# EAGLE design 2 byte output (EAGLE 9.4.2)
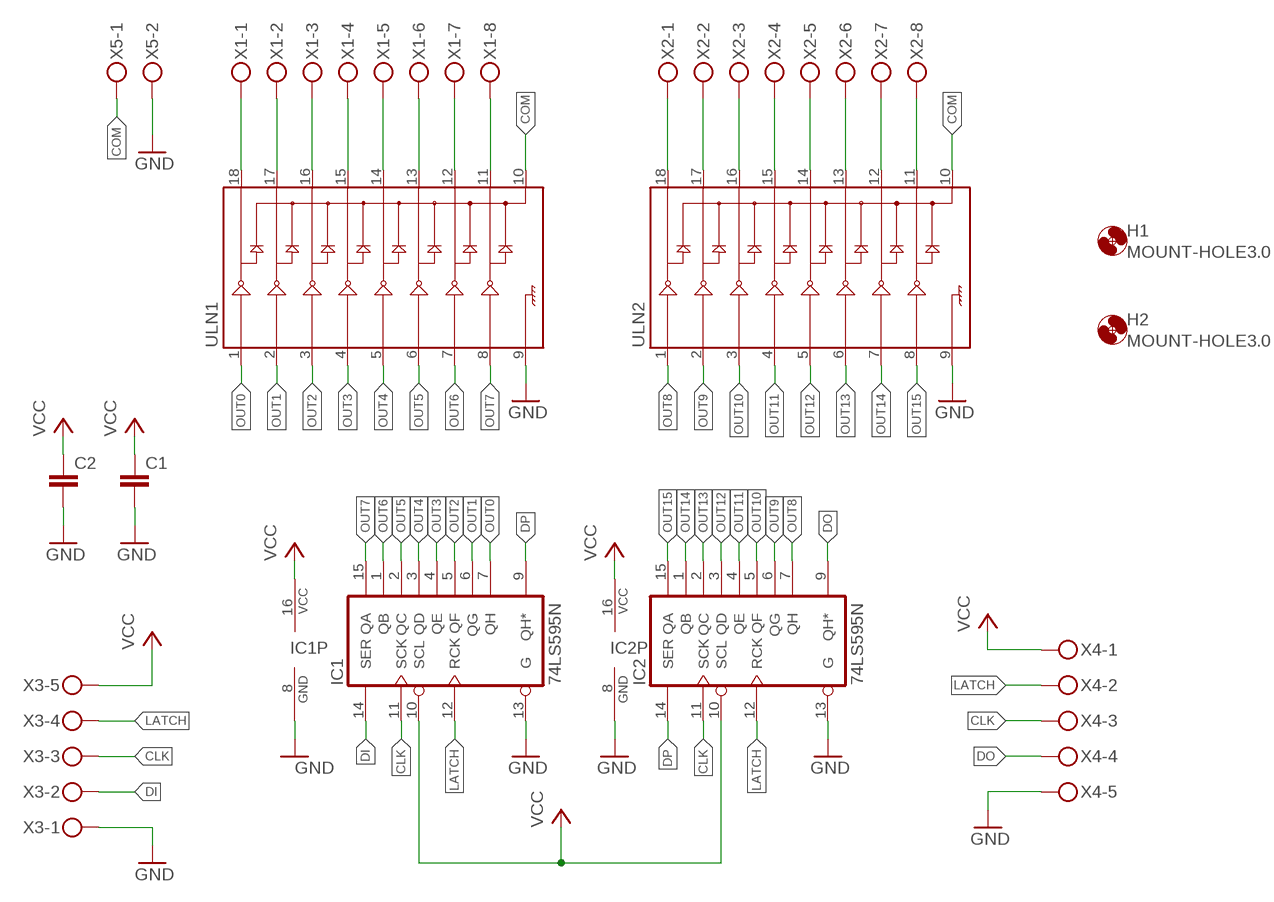
[diagram p0: schematic, sheet 1]

## Parts
C1  C-EU050-035X075  [C050-035X075]
C2  C-EU050-035X075  [C050-035X075]
H1  MOUNT-HOLE3.0  [3,0]
H2  MOUNT-HOLE3.0  [3,0]
IC1  74LS595N  [DIL16]
IC2  74LS595N  [DIL16]
ULN1  ULN2803DIP  [DIL18]
ULN2  ULN2803DIP  [DIL18]
X1  MKDSN1,5/8-5,08  [MKDSN1,5/8-5,08]
X2  MKDSN1,5/8-5,08  [MKDSN1,5/8-5,08]
X3  MKDSN1,5/5-5,08  [MKDSN1,5/5-5,08]
X4  MKDSN1,5/5-5,08  [MKDSN1,5/5-5,08]
X5  MKDSN1,5/2-5,08  [MKDSN1,5/2-5,08]

## Nets
CLK: IC1.11(SCK) IC2.11(SCK) X3.3 X4.3
COM: ULN1.10 ULN2.10 X5.1
DI: IC1.14(SER) X3.2
DO: IC2.9(QH*) X4.4
DP: IC1.9(QH*) IC2.14(SER)
GND: C1.2 C2.2 IC1.8(GND) IC1.13(G) IC2.8(GND) IC2.13(G) ULN1.9 ULN2.9 X3.1 X4.5 X5.2
LATCH: IC1.12(RCK) IC2.12(RCK) X3.4 X4.2
N$1: ULN1.18 X1.1
N$2: ULN1.17 X1.2
N$3: ULN1.16 X1.3
N$4: ULN1.15 X1.4
N$5: ULN1.14 X1.5
N$6: ULN1.13 X1.6
N$7: ULN1.12 X1.7
N$8: ULN1.11 X1.8
N$9: ULN2.18 X2.1
N$10: ULN2.17 X2.2
N$11: ULN2.16 X2.3
N$12: ULN2.15 X2.4
N$13: ULN2.14 X2.5
N$14: ULN2.13 X2.6
N$15: ULN2.12 X2.7
N$16: ULN2.11 X2.8
OUT0: IC1.7(QH) ULN1.1
OUT1: IC1.6(QG) ULN1.2
OUT2: IC1.5(QF) ULN1.3
OUT3: IC1.4(QE) ULN1.4
OUT4: IC1.3(QD) ULN1.5
OUT5: IC1.2(QC) ULN1.6
OUT6: IC1.1(QB) ULN1.7
OUT7: IC1.15(QA) ULN1.8
OUT8: IC2.7(QH) ULN2.1
OUT9: IC2.6(QG) ULN2.2
OUT10: IC2.5(QF) ULN2.3
OUT11: IC2.4(QE) ULN2.4
OUT12: IC2.3(QD) ULN2.5
OUT13: IC2.2(QC) ULN2.6
OUT14: IC2.1(QB) ULN2.7
OUT15: IC2.15(QA) ULN2.8
VCC: C1.1 C2.1 IC1.10(SCL) IC1.16(VCC) IC2.10(SCL) IC2.16(VCC) X3.5 X4.1

## Library data of the parts
C1 C2 = resistor:C-EU: CAPACITOR, European symbol
H1 H2 = holes:MOUNT-HOLE: MOUNTING HOLE with drill center marker
IC1 IC2 = 74xx-us:74*595: 8-bit SHIFT REGISTER, output latch
ULN1 ULN2 = SparkFun-IC-Special-Function:ULN2803: Darlington Driver(IC-07959, low stock) ULN2803 Darlington array. 500mA max per channel, 8-channel package. Spark Fun Electronics SKU : COM-00312
X1 X2 = con-phoenix-508:MKDSN1,5/8-5,08: MKDSN 1,5/ 8-5,08 Printklemme Nennstrom: 13,5 A Nennspannung: 250 V Rastermaß: 5,08 mm Polzahl: 8 Anschlussart: Schraubanschluss Montage: Löten Anschlussrichtung Leiter/Platine: 0 ° Artikelnummer: 1729186 Source: http://eshop.phoenixcontact.com .. 1729186.pdf
X3 X4 = con-phoenix-508:MKDSN1,5/5-5,08: MKDSN 1,5/ 5-5,08 Printklemme Nennstrom: 13,5 A Nennspannung: 250 V Rastermaß: 5,08 mm Polzahl: 5 Anschlussart: Schraubanschluss Montage: Löten Anschlussrichtung Leiter/Platine: 0 ° Artikelnummer: 1729157 Source: http://eshop.phoenixcontact.com .. 1729157.pdf
X5 = con-phoenix-508:MKDSN1,5/2-5,08: MKDSN 1,5/ 2-5,08 Printklemme Nennstrom: 13,5 A Nennspannung: 250 V Rastermaß: 5,08 mm Polzahl: 2 Anschlussart: Schraubanschluss Montage: Löten Anschlussrichtung Leiter/Platine: 0 ° Artikelnummer: 1729128 Source: http://eshop.phoenixcontact.com .. 1729128.pdf

## Board
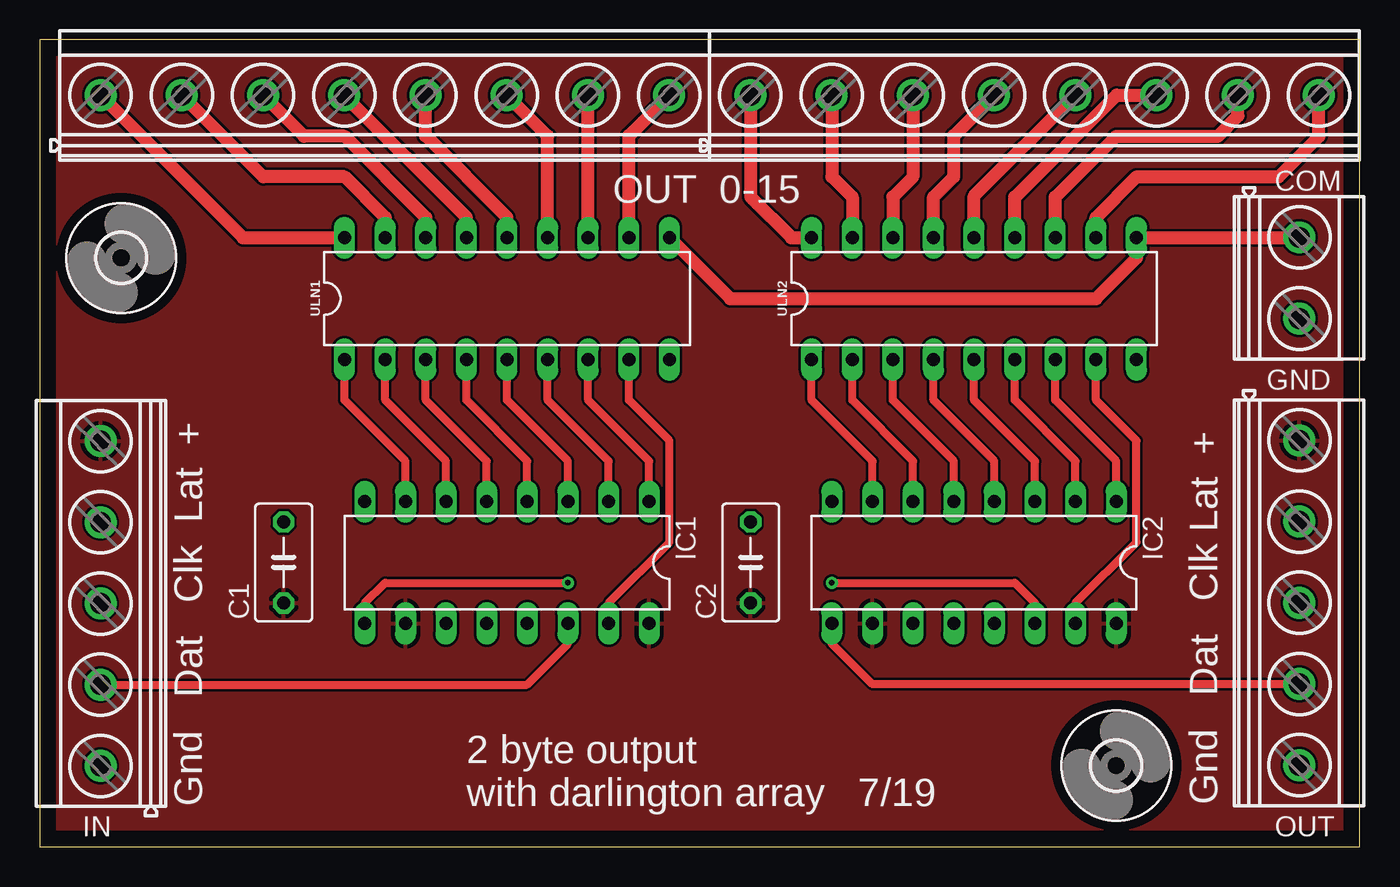
[diagram p1: board, top side]
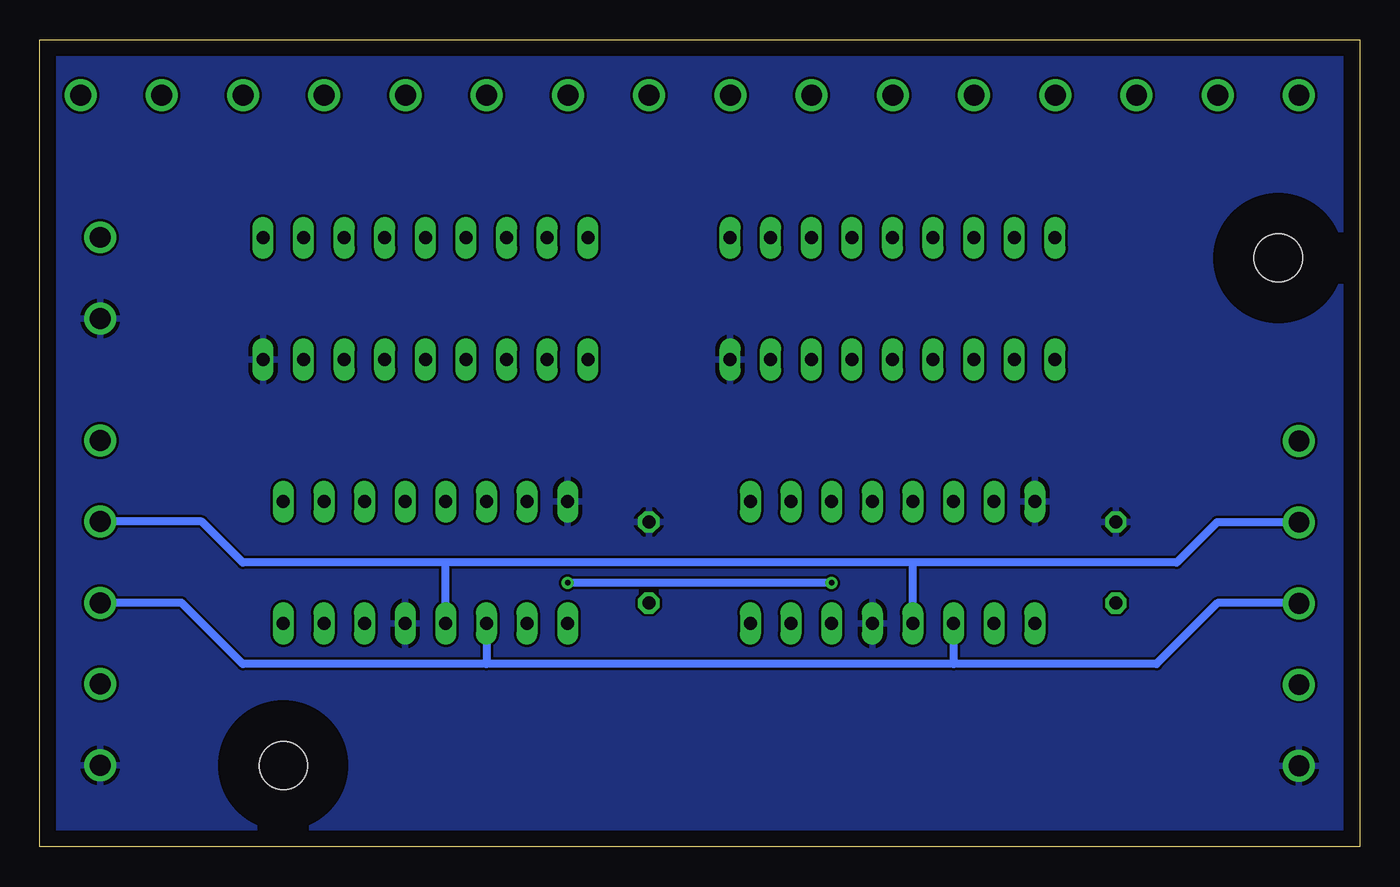
[diagram p2: board, bottom side, seen from below]

Size 82.53 x 50.47 mm. Coordinates in mm from the lower left corner, seen from the top.
Outline: 0,0 82.53,0 82.53,50.47 0,50.47 0,0
Copper layers (1*16): Top 0.035mm / dielectric 1.5mm / Bottom 0.035mm
Design rules "default": minimum track width 6mil, minimum drill 0.35mm, track to track 6mil, track to pad 6mil, pad to pad 6mil, via to via 6mil, smd to smd 6mil, copper to edge 40mil, drill to drill 6mil, minimum pad ring 10mil, minimum via ring 8mil, stop-mask expansion 4mil, vias tented up to drill 0mil, thermal gap 10mil

### Footprints (pad centres in the part's own frame; a part is rotated, then mirrored left to right if it is on the bottom)
C050-035X075 = drill 0.813 octagon: 1 -2.54,0; 2 2.54,0
3,0 = hole 3: 0,0
DIL16 = drill 0.813 long: 1 -8.89,-3.81; 2 -6.35,-3.81; 3 -3.81,-3.81; 4 -1.27,-3.81; 5 1.27,-3.81; 6 3.81,-3.81; 7 6.35,-3.81; 8 8.89,-3.81; 9 8.89,3.81; 10 6.35,3.81; 11 3.81,3.81; 12 1.27,3.81; 13 -1.27,3.81; 14 -3.81,3.81; 15 -6.35,3.81; 16 -8.89,3.81
DIL18 = drill 0.813 long: 1 -10.16,-3.81; 2 -7.62,-3.81; 3 -5.08,-3.81; 4 -2.54,-3.81; 5 0,-3.81; 6 2.54,-3.81; 7 5.08,-3.81; 8 7.62,-3.81; 9 10.16,-3.81; 10 10.16,3.81; 11 7.62,3.81; 12 5.08,3.81; 13 2.54,3.81; 14 0,3.81; 15 -2.54,3.81; 16 -5.08,3.81; 17 -7.62,3.81; 18 -10.16,3.81
MKDSN1,5/8-5,08 = drill 1.3 pad 2: 1 -17.801,0.025; 2 -12.721,0.025; 3 -7.641,0.025; 4 -2.561,0.025; 5 2.519,0.025; 6 7.599,0.025; 7 12.679,0.025; 8 17.759,0.025
MKDSN1,5/5-5,08 = drill 1.3 pad 2: 1 -10.181,0.025; 2 -5.101,0.025; 3 -0.021,0.025; 4 5.059,0.025; 5 10.139,0.025
MKDSN1,5/2-5,08 = drill 1.3 pad 2: 1 -2.561,0.025; 2 2.519,0.025

### Placement (x,y rotation side)
C1  15.24,17.78 90 top
C2  44.45,17.78 90 top
H1  5.08,36.83 0 top
H2  67.31,5.08 0 top
IC1  29.21,17.78 180 top
IC2  58.42,17.78 180 top
ULN1  29.21,34.29 0 top
ULN2  58.42,34.29 0 top
X1  21.59,46.99 0 top
X2  62.23,46.99 0 top
X3  3.81,15.24 90 top
X4  78.74,15.24 270 top
X5  78.74,35.56 270 top

### Tracks (layer width: path | path; a pad name or v marks a point on that pad's centre or on a via)
CLK
  Bottom 0.508: X3.3 3.81,15.24 8.89,15.24 12.7,11.43 25.4,11.43 | 25.4,11.43 54.61,11.43 | 54.61,11.43 69.85,11.43 73.68,15.26 X4.3 | IC1.11 25.4,11.43 | IC2.11 54.61,11.43
COM
  Top 0.813: ULN1.10 43.18,34.29 66.04,34.29 68.58,36.83 ULN2.10 78.74,38.1 X5.1
DI
  Top 0.508: X3.2 30.46,10.14 33.02,12.7 IC1.14
DO
  Top 0.508: X4.4 78.74,10.16 52.07,10.16 49.53,12.7 IC2.9
DP  (via drill 0.35)
  Top 0.508: IC1.9 20.32,15.24 21.59,16.51 v33.02,16.51 | IC2.14 62.23,15.24 60.96,16.51 v49.53,16.51
  Bottom 0.508: v33.02,16.51 v49.53,16.51
GND
  pour Bottom: -3.81,95.25 147.32,95.25 147.32,-2.54 -3.81,-2.54
LATCH
  Bottom 0.508: X3.4 8.91,20.3 11.43,17.78 27.94,17.78 | 27.94,17.78 57.15,17.78 | 57.15,17.78 69.85,17.78 72.41,20.34 X4.2 | IC1.12 27.94,17.78 | IC2.12 57.15,17.78
N$1
  Top 0.813: X1.1 12.7,38.1 ULN1.18
N$2
  Top 0.813: ULN1.17 21.59,39.37 19.05,41.91 13.97,41.91 X1.2
N$3
  Top 0.813: ULN1.16 24.13,39.37 19.05,44.45 16.51,44.45 X1.3
N$4
  Top 0.813: X1.4 26.67,39.37 ULN1.15
N$5
  Top 0.813: ULN1.14 29.21,39.37 24.11,44.47 X1.5
N$6
  Top 0.813: X1.6 31.75,44.45 ULN1.13
N$7
  Top 0.813: ULN1.12 34.27,38.12 X1.7
N$8
  Top 0.813: X1.8 36.83,44.5 ULN1.11
N$9
  Top 0.813: X2.1 44.45,46.99 44.45,40.64 46.99,38.1 ULN2.18
N$10
  Top 0.813: X2.2 49.53,46.99 49.53,41.91 50.8,40.64 ULN2.17
N$11
  Top 0.813: X2.3 54.59,41.89 53.34,40.64 ULN2.16
N$12
  Top 0.813: ULN2.15 55.88,40.64 57.15,41.91 57.15,44.5 X2.4
N$13
  Top 0.813: X2.5 58.42,40.69 ULN2.14
N$14
  Top 0.813: ULN2.13 60.96,40.64 67.33,47.02 X2.6
N$15
  Top 0.813: ULN2.12 63.5,40.64 67.31,44.45 73.66,44.45 74.93,45.72 74.93,46.99 X2.7
N$16
  Top 0.813: ULN2.11 66.04,39.37 68.58,41.91 77.47,41.91 79.99,44.43 X2.8
OUT0
  Top 0.508: IC1.7 22.86,24.13 19.05,27.94 ULN1.1
OUT1
  Top 0.508: IC1.6 25.4,24.13 21.59,27.94 ULN1.2
OUT2
  Top 0.508: IC1.5 27.94,24.13 24.13,27.94 ULN1.3
OUT3
  Top 0.508: IC1.4 30.48,24.13 26.67,27.94 ULN1.4
OUT4
  Top 0.508: IC1.3 33.02,24.13 29.21,27.94 ULN1.5
OUT5
  Top 0.508: IC1.2 35.56,24.13 31.75,27.94 ULN1.6
OUT6
  Top 0.508: IC1.1 38.1,24.13 34.29,27.94 ULN1.7
OUT7
  Top 0.508: IC1.15 35.56,15.24 39.37,19.05 39.37,25.4 36.83,27.94 ULN1.8
OUT8
  Top 0.508: IC2.7 52.07,24.13 48.26,27.94 ULN2.1
OUT9
  Top 0.508: IC2.6 54.61,24.13 50.8,27.94 ULN2.2
OUT10
  Top 0.508: IC2.5 57.15,24.13 53.34,27.94 ULN2.3
OUT11
  Top 0.508: IC2.4 59.69,24.13 55.88,27.94 ULN2.4
OUT12
  Top 0.508: IC2.3 62.23,24.13 58.42,27.94 ULN2.5
OUT13
  Top 0.508: IC2.2 64.77,24.13 60.96,27.94 ULN2.6
OUT14
  Top 0.508: IC2.1 67.31,24.13 63.5,27.94 ULN2.7
OUT15
  Top 0.508: IC2.15 64.77,15.24 68.58,19.05 68.58,25.4 66.04,27.94 ULN2.8
VCC
  pour Top: -2.54,-3.81 -2.54,58.42 87.63,58.42 87.63,-3.81

### Text on the board
tNames: COM | OUT 0-15 | GND | Gnd Dat Clk Lat + | 2 byte output / with darlington array 7/19 | IN | Gnd Dat Clk Lat + | OUT